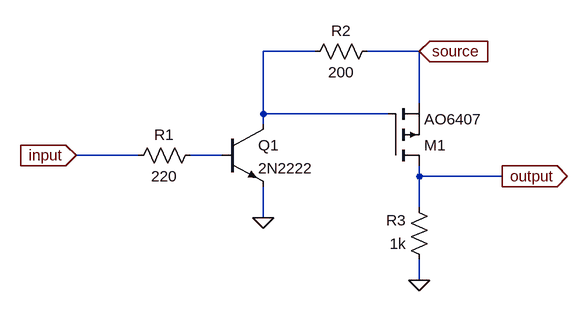
[diagram p0: schematic bloc_transistor.asc]
bloc_transistor.asc, the LTspice schematic file:
Version 4.1
SHEET 1 880 680
WIRE 16 32 -64 32
WIRE 176 32 96 32
WIRE 176 112 176 32
WIRE -64 128 -64 32
WIRE 128 128 -64 128
WIRE -64 144 -64 128
WIRE -256 192 -352 192
WIRE -128 192 -176 192
WIRE 176 224 176 208
WIRE 304 224 176 224
WIRE 176 272 176 224
WIRE -64 288 -64 240
WIRE 176 384 176 352
FLAG -64 288 0
FLAG 176 384 0
FLAG -352 192 input
IOPIN -352 192 In
FLAG 304 224 output
IOPIN 304 224 Out
FLAG 176 32 source
IOPIN 176 32 In
SYMBOL pmos 128 208 M180
SYMATTR InstName M1
SYMATTR Value AO6407
SYMBOL npn -128 144 R0
SYMATTR InstName Q1
SYMATTR Value 2N2222
SYMBOL res -160 176 R90
WINDOW 0 0 56 VBottom 2
WINDOW 3 32 56 VTop 2
SYMATTR InstName R1
SYMATTR Value 220
SYMBOL res 112 16 R90
WINDOW 0 0 56 VBottom 2
WINDOW 3 32 56 VTop 2
SYMATTR InstName R2
SYMATTR Value 200
SYMBOL res 192 368 R180
WINDOW 0 36 76 Left 2
WINDOW 3 36 40 Left 2
SYMATTR InstName R3
SYMATTR Value 1k

The netlist it stands for:
* bloc_transistor.asc
M1 output N001 source source AO6407
Q1 N001 N002 0 0 2N2222
R1 N002 input 220
R2 source N001 200
R3 0 output 1k
.model NPN NPN
.model PNP PNP
.lib standard.bjt
.model NMOS NMOS
.model PMOS PMOS
.lib standard.mos
.backanno
.end